# Altium schematic sheet Overview.SchDoc: PMPi-PCB
size A; SheetNumber: 1; SheetTotal: 10
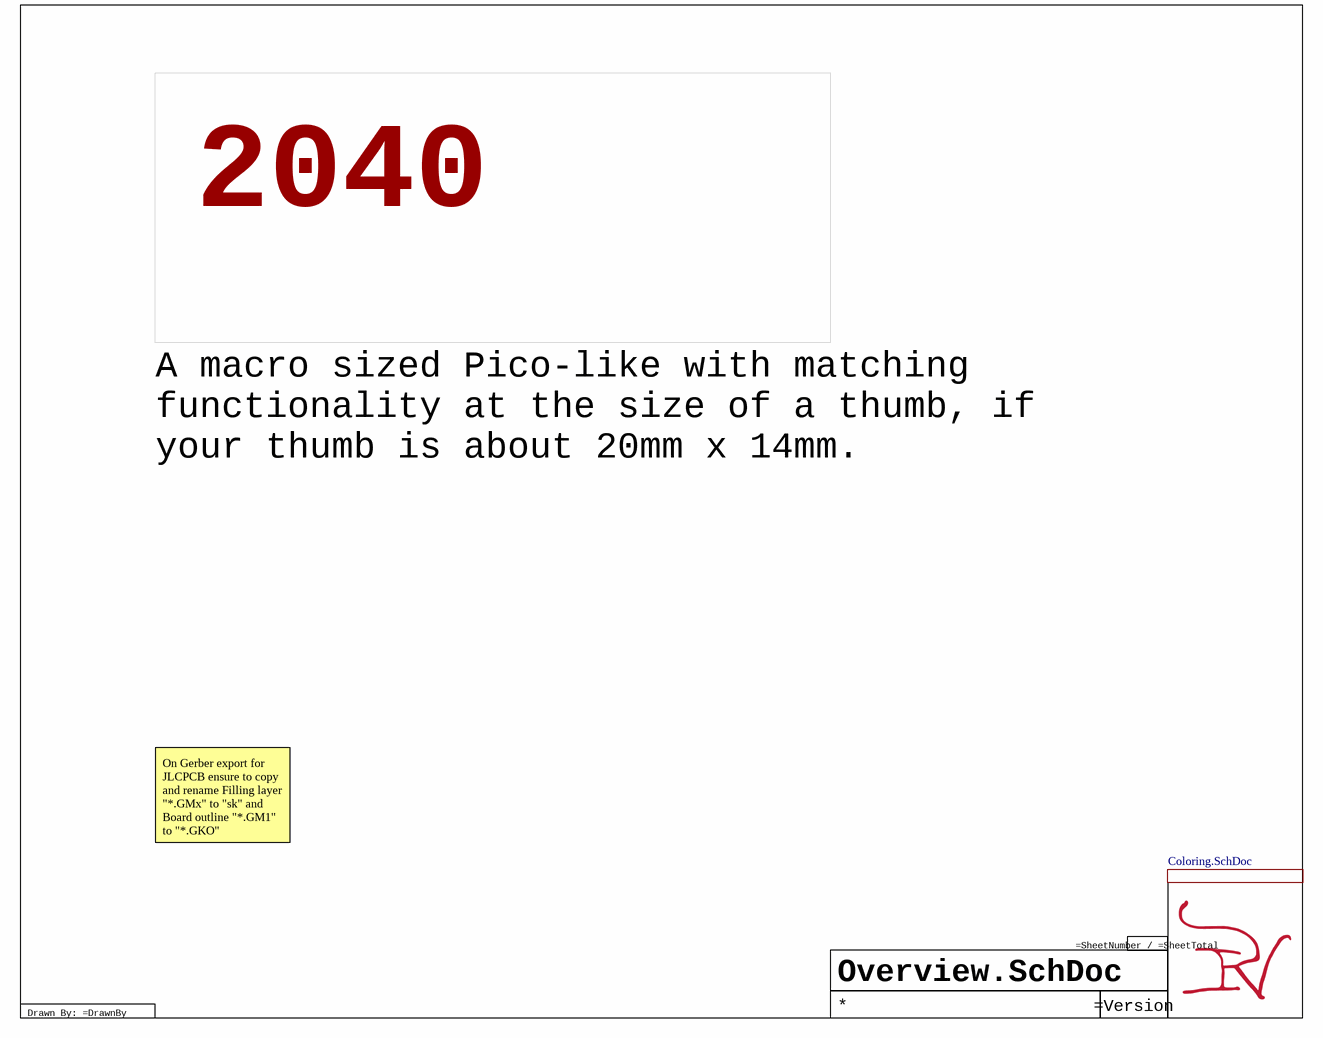
[diagram p0: Overview.SchDoc]

## Sub-sheets
LINK_ME_AND_HIDE_DESIGNATOR = 2040Macro-PCB.SchDoc: no entries
U_Coloring = Coloring.SchDoc: no entries

## Notes on the sheet
- 2040
- A macro sized Pico-like with matching functionality at the size of a thumb, if your thumb is about 20mm x 14mm.
- On Gerber export for JLCPCB ensure to copy and rename Filling layer "*.GMx" to "sk" and Board outline "*.GM1" to "*.GKO"
- Drawn By: =DrawnBy